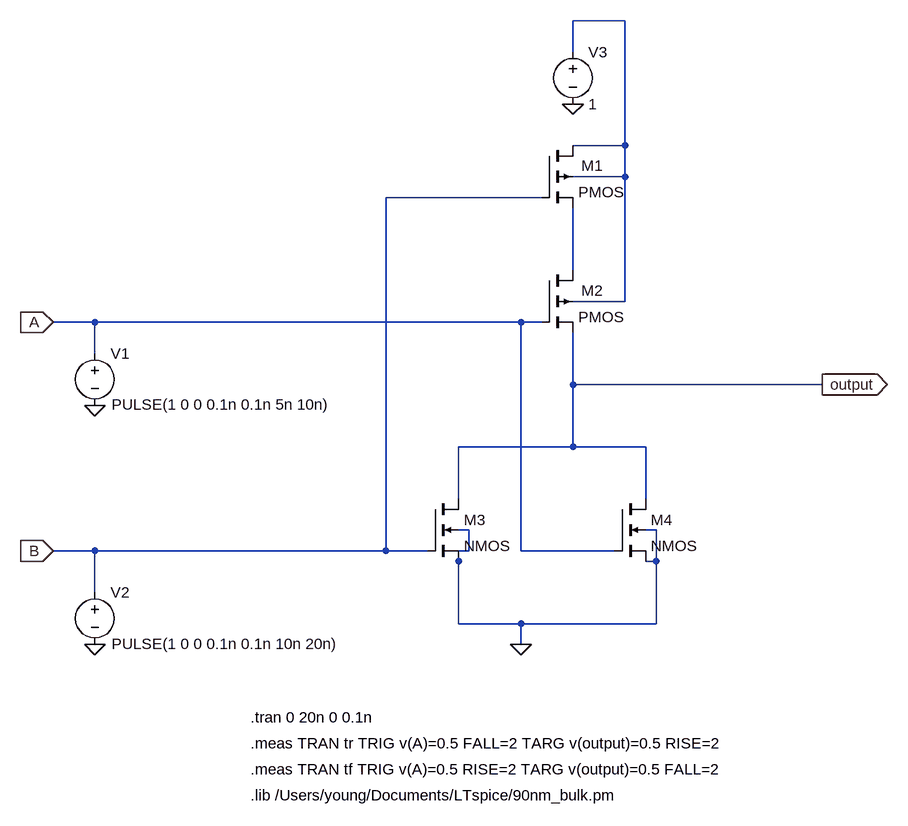
[diagram p0: schematic nor.asc]
nor.asc, the LTspice schematic file:
Version 4
SHEET 1 1524 1152
WIRE 608 -272 528 -272
WIRE 528 -224 528 -272
WIRE 608 -80 608 -272
WIRE 608 -80 528 -80
WIRE 608 -32 608 -80
WIRE 608 -32 528 -32
WIRE 480 0 240 0
WIRE 528 112 528 16
WIRE 608 160 608 -32
WIRE 608 160 528 160
WIRE -208 192 -272 192
WIRE 448 192 -208 192
WIRE 480 192 448 192
WIRE -208 240 -208 192
WIRE 528 288 528 208
WIRE 912 288 528 288
WIRE 528 384 528 288
WIRE 528 384 352 384
WIRE 640 384 528 384
WIRE 352 464 352 384
WIRE 640 464 640 384
WIRE 368 512 352 512
WIRE 656 512 640 512
WIRE -208 544 -272 544
WIRE 240 544 240 0
WIRE 240 544 -208 544
WIRE 304 544 240 544
WIRE 368 544 368 512
WIRE 368 544 352 544
WIRE 448 544 448 192
WIRE 592 544 448 544
WIRE 352 560 352 544
WIRE 656 560 656 512
WIRE 656 560 640 560
WIRE -208 608 -208 544
WIRE 352 656 352 560
WIRE 448 656 352 656
WIRE 656 656 656 560
WIRE 656 656 448 656
WIRE 448 688 448 656
FLAG -272 192 A
IOPIN -272 192 In
FLAG -272 544 B
IOPIN -272 544 In
FLAG 912 288 output
IOPIN 912 288 Out
FLAG -208 688 0
FLAG -208 320 0
FLAG 448 688 0
FLAG 528 -144 0
SYMBOL voltage -208 224 R0
WINDOW 3 26 95 Left 2
WINDOW 123 0 0 Left 0
WINDOW 39 0 0 Left 0
SYMATTR Value PULSE(1 0 0 0.1n 0.1n 5n 10n)
SYMATTR InstName V1
SYMBOL voltage -208 592 R0
WINDOW 3 26 95 Left 2
WINDOW 123 0 0 Left 0
WINDOW 39 0 0 Left 0
SYMATTR Value PULSE(1 0 0 0.1n 0.1n 10n 20n)
SYMATTR InstName V2
SYMBOL pmos4 480 -80 R0
WINDOW 0 61 31 Left 2
SYMATTR InstName M1
SYMATTR Value2 l=200N w=600N
SYMBOL pmos4 480 112 R0
WINDOW 0 61 31 Left 2
SYMATTR InstName M2
SYMATTR Value2 l=200N w=600N
SYMBOL nmos4 304 464 R0
SYMATTR InstName M3
SYMATTR Value2 l=200N w=200N
SYMBOL nmos4 592 464 R0
SYMATTR InstName M4
SYMATTR Value2 l=200N w=200N
SYMBOL voltage 528 -240 R0
WINDOW 123 0 0 Left 0
WINDOW 39 0 0 Left 0
SYMATTR InstName V3
SYMATTR Value 1
TEXT 32 800 Left 2 !.tran 0 20n 0 0.1n
TEXT 32 840 Left 2 !.meas TRAN tr TRIG v(A)=0.5 FALL=2 TARG v(output)=0.5 RISE=2
TEXT 32 880 Left 2 !.meas TRAN tf TRIG v(A)=0.5 RISE=2 TARG v(output)=0.5 FALL=2
TEXT 32 920 Left 2 !.lib /Users/young/Documents/LTspice/90nm_bulk.pm

The netlist it stands for:
* nor.asc
V1 A 0 PULSE(1 0 0 0.1n 0.1n 5n 10n)
V2 B 0 PULSE(1 0 0 0.1n 0.1n 10n 20n)
M1 N001 B N002 N001 PMOS l=200N w=600N
M2 N002 A output N001 PMOS l=200N w=600N
M3 output B 0 0 NMOS l=200N w=200N
M4 output A 0 0 NMOS l=200N w=200N
V3 N001 0 1
.model NMOS NMOS
.model PMOS PMOS
.lib standard.mos
.tran 0 20n 0 0.1n
.meas TRAN tr TRIG v(A)=0.5 FALL=2 TARG v(output)=0.5 RISE=2
.meas TRAN tf TRIG v(A)=0.5 RISE=2 TARG v(output)=0.5 FALL=2
.lib /Users/young/Documents/LTspice/90nm_bulk.pm
.backanno
.end